# Altium schematic sheet [07]-PowerSupply.SchDoc: Powersupplies (part 1 of 4)
size A3; Organization: Toradex AG; Address1: Altsagenstrasse 5; Address2: Horw; Address3: 6048; Address4: Switzerland; DocumentNumber: 7; Revision: V3.2; SheetNumber: 7; SheetTotal: 26; PageSetup: Record=PageOptions|CenterHorizontal=True|CenterVertical=True|PrintScale=0.73|XCorrection=1.00|YCorrection=1.00|PrintKind=0|BorderSize=5000000|LeftOffset=0|BottomOffset=0|Orientation=2|PaperLength=1000|PaperWidth=1000|Scale=100|PaperSource=7|PrintQuality=-4|MediaType=1|DitherType=10|PaperKind=A4|PrintScaleMode=1
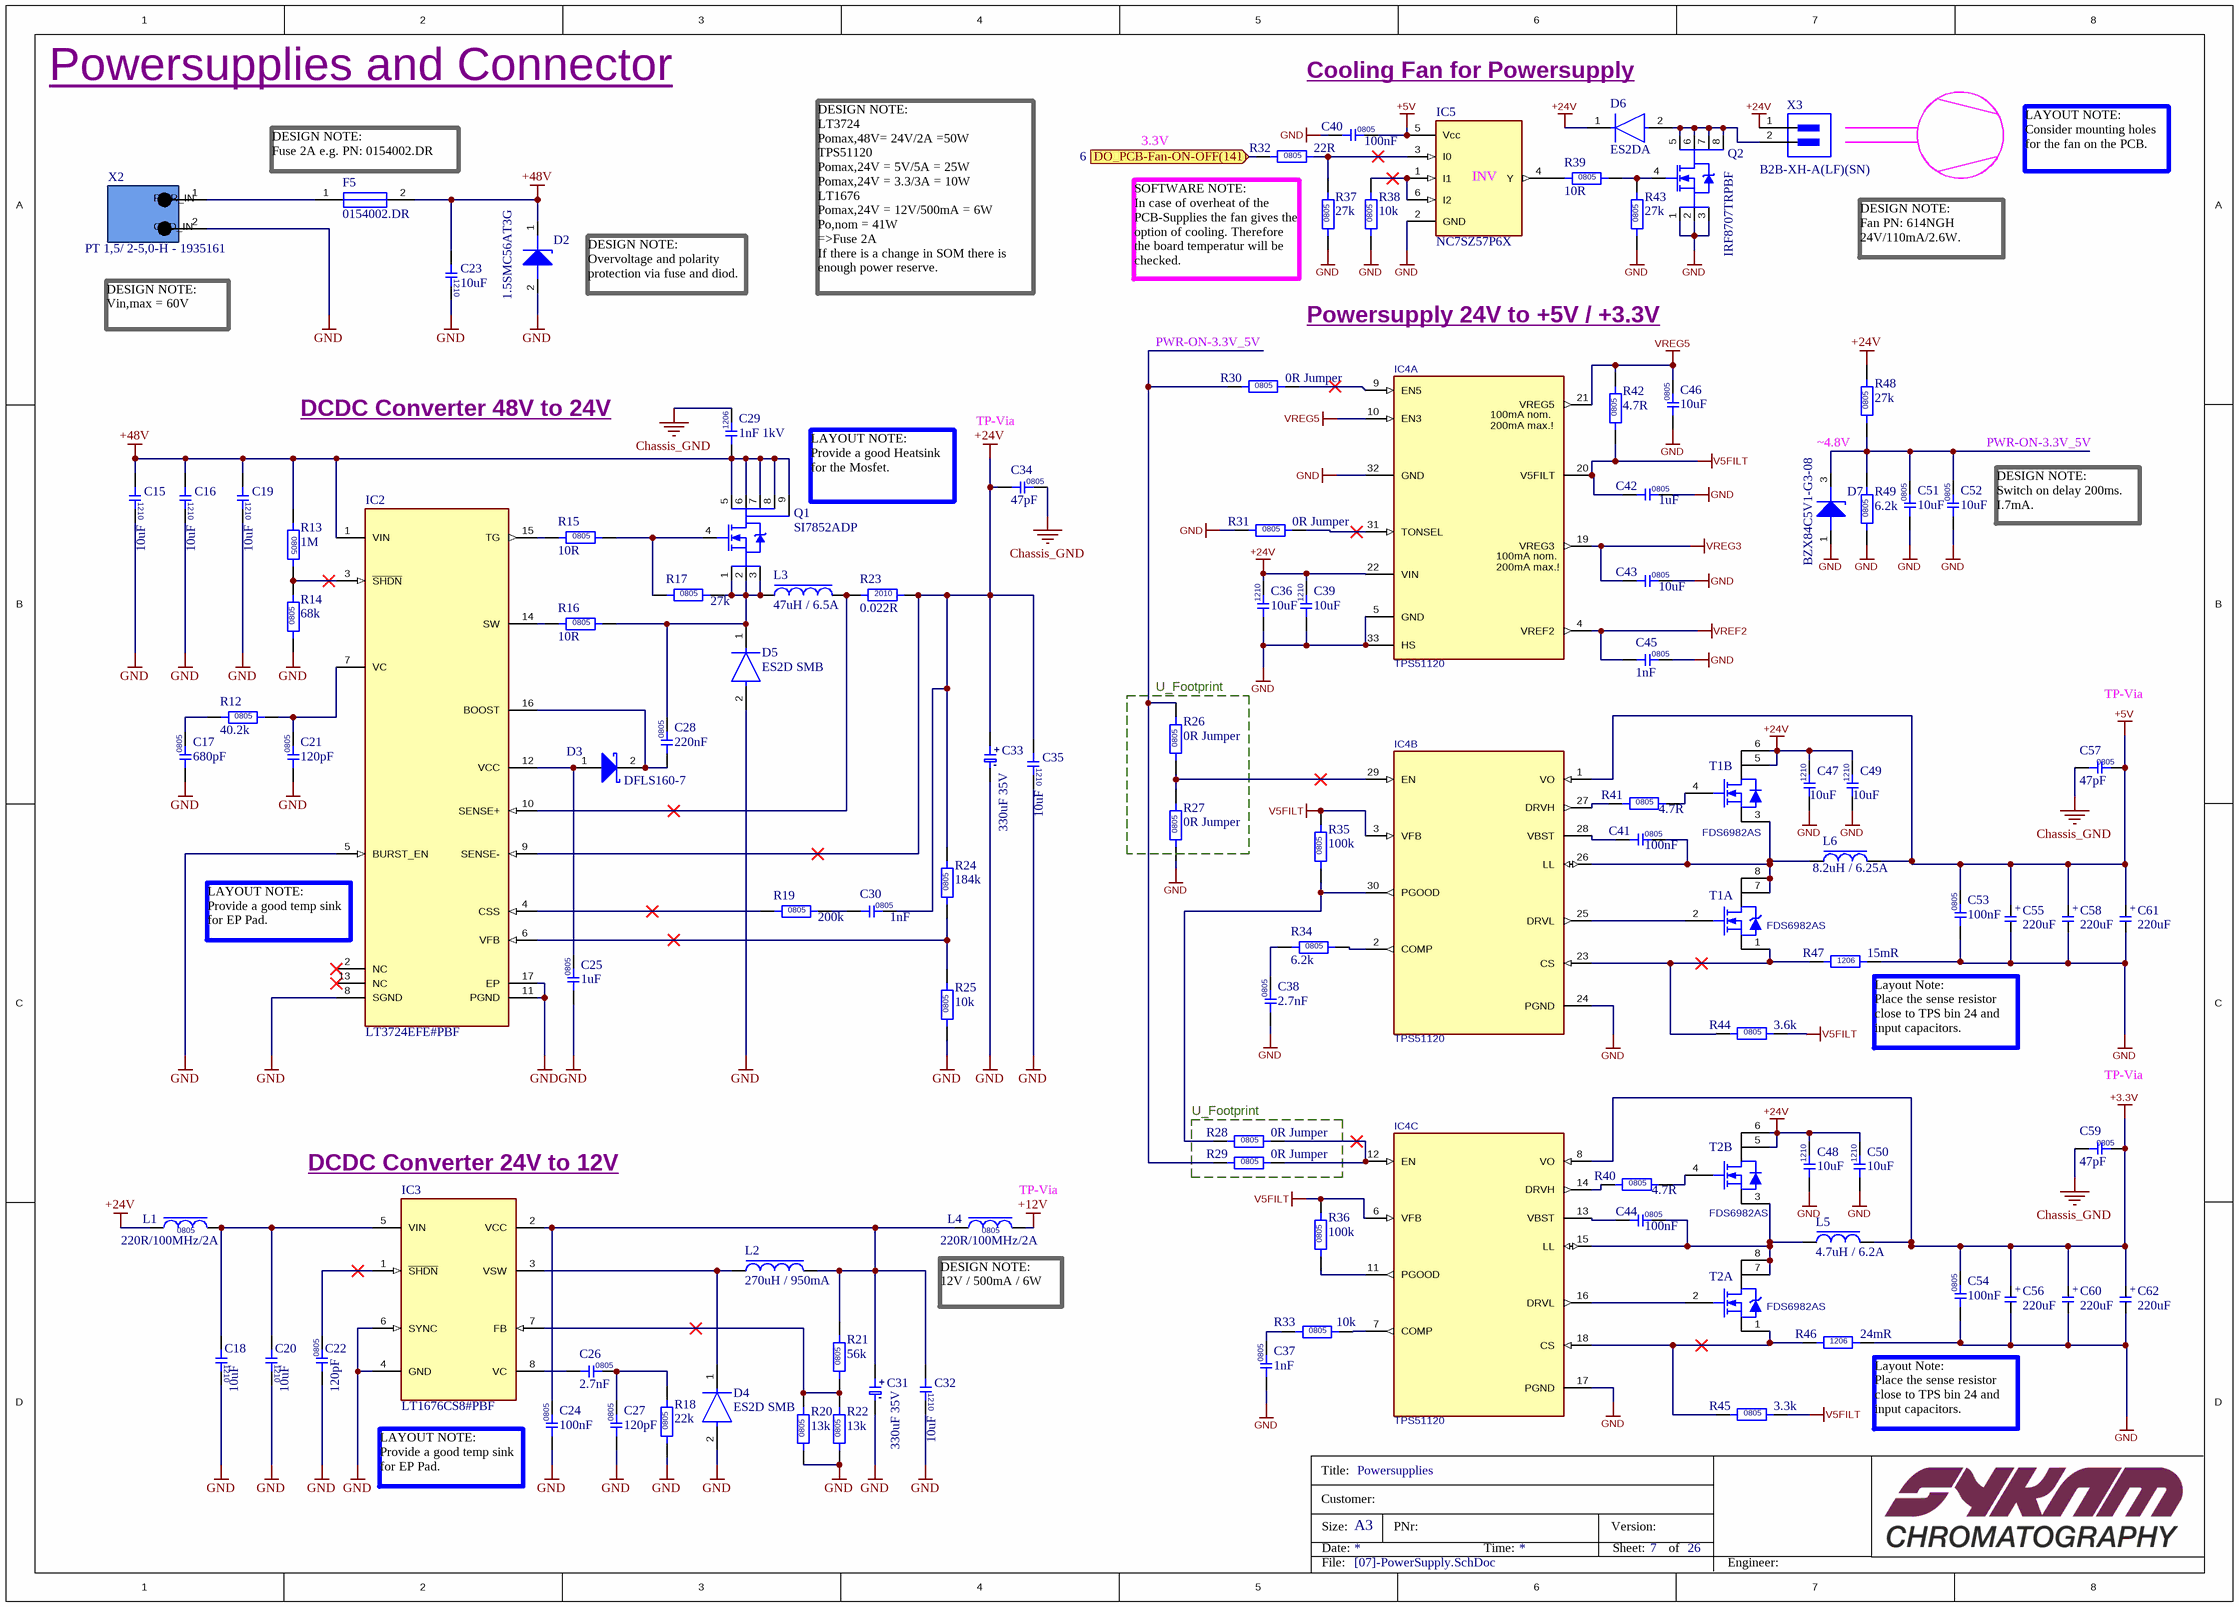
[diagram p0: [07]-PowerSupply.SchDoc]

## Parts
C15  10uF  [C1210]
C16  10uF  [C1210]
C17  680pF  [C0805]
C18  10uF  [C1210]
C19  10uF  [C1210]
C20  10uF  [C1210]
C21  120pF  [C0805]
C22  120pF  [C0805]
C23  10uF  [C1210]
C24  100nF  [C0805]
C25  1uF  [C0805]
C26  2.7nF  [C0805]
C27  120pF  [C0805]
C28  220nF  [C0805]
C29  1nF 1kV  [C1206]
C30  1nF  [C0805]
C31  330uF 35V  [C_EEEFP1V331AP]
C32  10uF  [C1210]
C33  330uF 35V  [C_EEEFP1V331AP]
C34  47pF  [C0805]
C35  10uF  [C1210]
C36  10uF  [C1210]
C37  1nF  [C0805]
C38  2.7nF  [C0805]
C39  10uF  [C1210]
C40  100nF  [C0805]
C41  100nF  [C0805]
C42  1uF  [C0805]
C43  10uF  [C0805]
C44  100nF  [C0805]
C45  1nF  [C0805]
C46  10uF  [C0805]
C47  10uF  [C1210]
C48  10uF  [C1210]
C49  10uF  [C1210]
C50  10uF  [C1210]
C51  10uF  [C0805]
C52  10uF  [C0805]
C53  100nF  [C0805]
C54  100nF  [C0805]
C55  220uF  [C_220uF_TAN_TPSD227M010R0100]
C56  220uF  [C_220uF_TAN_TPSD227M010R0100]
C57  47pF  [C0805]
C58  220uF  [C_220uF_TAN_TPSD227M010R0100]
C59  47pF  [C0805]
C60  220uF  [C_220uF_TAN_TPSD227M010R0100]
C61  220uF  [C_220uF_TAN_TPSD227M010R0100]
C62  220uF  [C_220uF_TAN_TPSD227M010R0100]
D2  1.5SMC56AT3G  [D-TVS_SMC_UNI]
D3  DFLS160-7  [D_POWERDI123]
D4  ES2D SMB  [FB-SMB]
D5  ES2D SMB  [FB-SMB]
D6  ES2DA  [FP-SMA-MFG]
D7  BZX84C5V1-G3-08  [BZX84C5.1V-SOT-23-3]
F5  0154002.DR  [F_FUSE-154002]
IC2  LT3724EFE#PBF  [LT3724_LT-FE-16-EPV-BC_L]
IC3  LT1676CS8#PBF  [LT1676-SOIC8]
IC4  TPS51120  [QFN50P500X500X100-33N]  (parts A,B,C of 3)
IC5  NC7SZ57P6X  [NC7SZ57P6X]
L1  220R/100MHz/2A  [L0805]
L2  270uH / 950mA  [L_SRR1208_271KL]
L3  47uH / 6.5A  [L_SRP1265A]
L4  220R/100MHz/2A  [L0805]
L5  4.7uH / 6.2A  [7447797470-WE-PDF-1045]
L6  8.2uH / 6.25A  [744771008-WE-PD-L]
Q1  SI7852ADP  [SI7852ADP_NMOS-PowerPAK-SO-8]
Q2  IRF8707TRPBF  [IRF8707_SOIC8]
R12  40.2k  [R0805]
R13  1M  [R0805]
R14  68k  [R0805]
R15  10R  [R0805]
R16  10R  [R0805]
R17  27k  [R0805]
R18  22k  [R0805]
R19  200k  [R0805]
R20  13k  [R0805]
R21  56k  [R0805]
R22  13k  [R0805]
R23  0.022R  [R2010]
R24  184k  [R0805]
R25  10k  [R0805]
R26  0R Jumper  [R0805]
R27  0R Jumper  [R0805]
R28  0R Jumper  [R0805]
R29  0R Jumper  [R0805]
R30  0R Jumper  [R0805]
R31  0R Jumper  [R0805]
R32  22R  [R0805]
R33  10k  [R0805]
R34  6.2k  [R0805]
R35  100k  [R0805]
R36  100k  [R0805]
R37  27k  [R0805]
R38  10k  [R0805]
R39  10R  [R0805]
R40  4.7R  [R0805]
R41  4.7R  [R0805]
R42  4.7R  [R0805]
R43  27k  [R0805]
R44  3.6k  [R0805]
R45  3.3k  [R0805]
R46  24mR  [R1206]
R47  15mR  [R1206]
R48  27k  [R0805]
R49  6.2k  [R0805]
T1  FDS6982AS  [SOIC127P600X173-8N]  (parts A,B of 2)
T2  FDS6982AS  [SOIC127P600X173-8N]  (parts A,B of 2)
X2  PT 1,5/ 2-5,0-H - 1935161  [CON_1935161-THT]
X3  B2B-XH-A(LF)(SN)  [CON_2p_JST-B2B-XH-A_V]

## Blocks framed on the sheet
U_Footprint: R26 R27
U_Footprint: R28 R29

## Ports
DO_PCB-Fan-ON-OFF(141) (in, see 6)

## Nets
+3.3V: C54.2 C56.1 C59.1 C60.1 C62.1 IC4.8(VO) L5.2
+5V: C40.2 C53.2 C55.1 C57.1 C58.1 C61.1 IC4.1(VO) IC5.5(Vcc) L6.2
+12V: L4.2
+24V: C30.2 C33.1 C34.1 C35.1 C36.2 C39.2 C47.2 C48.2 C49.2 C50.2 D6.1(C) IC2.9(SENSE-) IC4.22(VIN) L1.1 R23.2 R24.2 R48.2 T1.5(D) T1.6(D) T2.5(D) T2.6(D) X3.1
+48V: C15.1 C16.1 C19.1 C23.1 C29.1 D2.1(K) F5.2 IC2.1(VIN) Q1.5(D) Q1.6(D) Q1.7(D) Q1.8(D) Q1.9(D) R13.1
Chassis_GND: C29.2 C34.2 C57.2 C59.2
GND: C15.2 C16.2 C17.1 C18.2 C19.2 C20.2 C21.1 C22.1 C23.2 C24.1 C25.1 C27.1 C31.2 C32.2 C33.2 C35.2 C36.1 C37.1 C38.1 C39.1 C40.1 C42.2 C43.2 C45.2 C46.1 C47.1 C48.1 C49.1 C50.1 C51.1 C52.1 C53.1 C54.1 C55.2 C56.2 C58.2 C60.2 C61.2 C62.2 D2.2(A) D4.2(A) D5.2(A) D7.1(A) IC2.5(BURST_EN) IC2.8(SGND) IC2.11(PGND) IC2.17(EP) IC3.4(GND) IC3.6(SYNC) IC4.5(GND) IC4.17(PGND) IC4.24(PGND) IC4.32(GND) IC4.33(HS) IC5.2(GND) Q2.1(S) Q2.2(S) Q2.3(S) R14.1 R18.1 R20.1 R22.1 R25.1 R27.1 R31.1 R37.1 R38.1 R43.1 R46.2 R47.2 R49.1 X2.2(GND_IN)
V5FILT: C42.1 IC4.3(VFB) IC4.6(VFB) IC4.20(V5FILT) R35.2 R36.2 R42.1 R44.2 R45.2
VREF2: C45.1 IC4.4(VREF2)
VREG3: C43.1 IC4.19(VREG3)
VREG5: C46.2 IC4.10(EN3) IC4.21(VREG5) R42.2
DO_PCB-Fan-ON-OFF(141): R32.1 ; port DO_PCB-Fan-ON-OFF(141)
PWR-ON-3.3V_5V: C51.2 C52.2 D7.3(K) R26.2 R29.1 R30.1 R48.1 R49.2
NetC17_2: C17.2 R12.1
NetC18_1: C18.1 C20.1 IC3.5(VIN) L1.2
NetC21_2: C21.2 IC2.7(VC) R12.2
NetC22_2: C22.2 IC3.1(~{SHDN})
NetC24_2: C24.2 C31.1 C32.1 IC3.2(VCC) L2.2 L4.1 R21.2
NetC25_2: C25.2 D3.1(A) IC2.12(VCC)
NetC26_1: C26.1 IC3.8(VC)
NetC26_2: C26.2 C27.2 R18.2
NetC28_1: C28.1 D3.2(K) IC2.16(BOOST)
NetC28_2: C28.2 D5.1(C) L3.1 Q1.1(S) Q1.2(S) Q1.3(S) R16.2 R17.2
NetC30_1: C30.1 R19.2
NetC37_2: C37.2 R33.1
NetC38_2: C38.2 R34.1
NetC41_1: C41.1 IC4.28(VBST)
NetC41_2: C41.2 IC4.26(LL) L6.1 T1.3(S) T1.7(D) T1.8(D)
NetC44_1: C44.1 IC4.13(VBST)
NetC44_2: C44.2 IC4.15(LL) L5.1 T2.3(S) T2.7(D) T2.8(D)
NetD4_1: D4.1(C) IC3.3(VSW) L2.1
NetD6_2: D6.2(A) Q2.5(D) Q2.6(D) Q2.7(D) Q2.8(D) X3.2
NetF5_1: F5.1 X2.1(PWR_IN)
NetIC2_3: IC2.3(~{SHDN}) R13.2 R14.2
NetIC2_4: IC2.4(CSS) R19.1
NetIC2_6: IC2.6(VFB) R24.1 R25.2
NetIC2_10: IC2.10(SENSE+) L3.2 R23.1
NetIC2_14: IC2.14(SW) R16.1
NetIC2_15: IC2.15(TG) R15.1
NetIC3_7: IC3.7(FB) R20.2 R21.1 R22.2
NetIC4_2: IC4.2(COMP) R34.2
NetIC4_7: IC4.7(COMP) R33.2
NetIC4_9: IC4.9(EN5) R30.2
NetIC4_11: IC4.11(PGOOD) R36.1
NetIC4_12: IC4.12(EN) R28.2 R29.2
NetIC4_14: IC4.14(DRVH) R40.1
NetIC4_16: IC4.16(DRVL) T2.2(G)
NetIC4_18: IC4.18(CS) R45.1 R46.1 T2.1(S)
NetIC4_23: IC4.23(CS) R44.1 R47.1 T1.1(S)
NetIC4_25: IC4.25(DRVL) T1.2(G)
NetIC4_27: IC4.27(DRVH) R41.1
NetIC4_29: IC4.29(EN) R26.1 R27.2
NetIC4_30: IC4.30(PGOOD) R28.1 R35.1
NetIC4_31: IC4.31(TONSEL) R31.2
NetIC5_1: IC5.1(I1) IC5.6(I2) R38.2
NetIC5_3: IC5.3(I0) R32.2 R37.2
NetIC5_4: IC5.4(Y) R39.1
NetQ1_4: Q1.4(G) R15.2 R17.1
NetQ2_4: Q2.4(G) R39.2 R43.2
NetR40_2: R40.2 T2.4(G)
NetR41_2: R41.2 T1.4(G)

Not connected (* = marked no-connect by the designer): IC2 2(NC)* 13(NC)*

## Notes on the sheet
- Powersupplies and Connector
- Cooling Fan for Powersupply
- (near F5) DESIGN NOTE:
  Fuse 2A e.g. PN: 0154002.DR
- 3.3V
- (near IC5) INV
- LAYOUT NOTE:
  Consider mounting holes for the fan on the PCB.
- DESIGN NOTE:
  Fan PN: 614NGH 24V/110mA/2.6W.
- (near X2) DESIGN NOTE:
  Vin,max = 60V
- (near D2) DESIGN NOTE:
  Overvoltage and polarity protection via fuse and diod.
- DESIGN NOTE:
  LT3724
  Pomax,48V= 24V/2A =50W
  TPS51120
  Pomax,24V = 5V/5A = 25W
  Pomax,24V = 3.3/3A = 10W
  LT1676
  Pomax,24V = 12V/500mA = 6W
  Po,nom = 41W
  =>Fuse 2A
  If there is a change in SOM there is enough power reserve.
- SOFTWARE NOTE:
  In case of overheat of the PCB-Supplies the fan gives the option of cooling. Therefore the board temperatur will be checked.
- Powersupply 24V to +5V / +3.3V
- DCDC Converter 48V to 24V
- TP-Via
- ~4.8V
- (near Q1) LAYOUT NOTE:
  Provide a good Heatsink for the Mosfet.
- (near C52) DESIGN NOTE:
  Switch on delay 200ms.
  I.7mA.
- (near IC2) LAYOUT NOTE:
  Provide a good temp sink for EP Pad.
- (near R47) Layout Note:
  Place the sense resistor close to TPS bin 24 and input capacitors.
- (near IC3) DCDC Converter 24V to 12V
- (near L4) TP-Via
- (near L4) DESIGN NOTE:
  12V / 500mA / 6W
- (near C24) LAYOUT NOTE:
  Provide a good temp sink for EP Pad.
- Title:
- (near R46) Layout Note:
  Place the sense resistor close to TPS bin 24 and input capacitors.
- Customer:
- Size:
- Date:
- A3
- PNr:
- Time:
- Version:
- Sheet:
- of
- File:
- Engineer:
- Title
- Number:
- Revision:
- Sheet
- (in symbol C_220uF_TAN_TPSD227M010R0100) +
- (in symbol C_330uF_35V_EEEFP1V331AP) +; -
- (in symbol IC-TI-TPS51120, part A) 100mA nom.; 200mA max.!